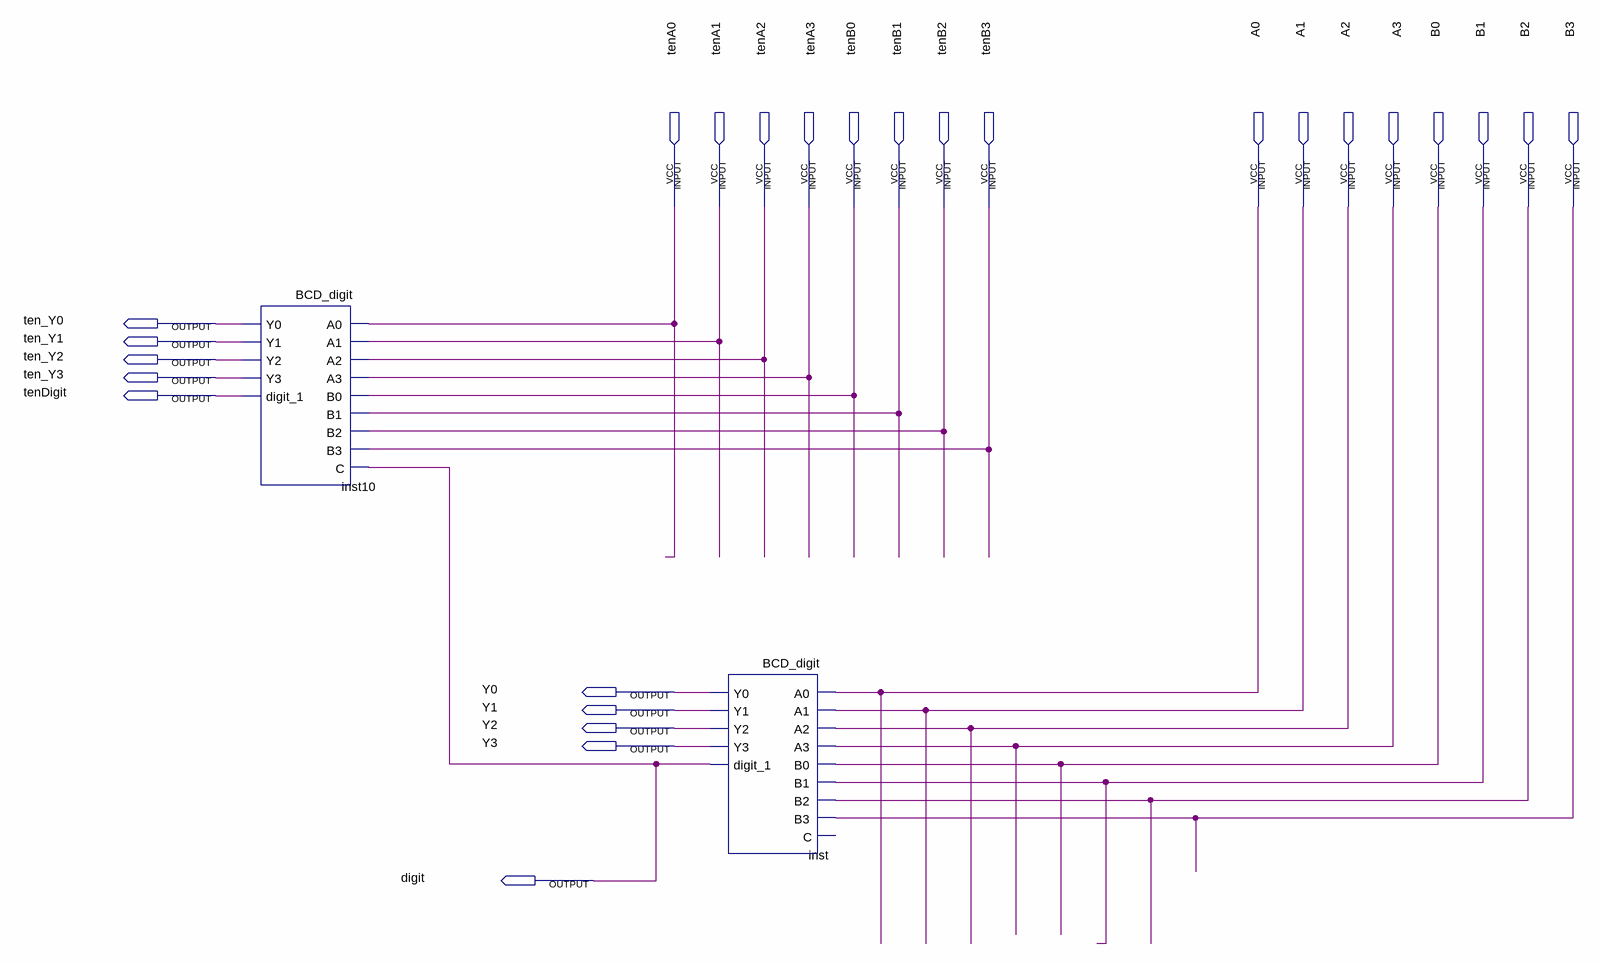
[diagram p0: schematic sheet]
// Quartus schematic BCD_ten_digit.bdf as structural Verilog: 2 symbols, 26 pins
module BCD_ten_digit (
  input  tenA0,
  input  tenA1,
  input  tenA2,
  input  tenA3,
  input  tenB0,
  input  tenB1,
  input  tenB2,
  input  tenB3,
  input  A0,
  input  A1,
  input  A2,
  input  A3,
  input  B0,
  input  B1,
  input  B2,
  input  B3,
  output ten_Y0,
  output ten_Y1,
  output ten_Y2,
  output ten_Y3,
  output tenDigit,
  output Y0,
  output Y1,
  output Y2,
  output Y3,
  output digit
);

  BCD_digit inst10 (
    .A0(tenA0), .A1(tenA1), .A2(tenA2), .A3(tenA3), .B0(tenB0), .B1(tenB1), .B2(tenB2), .B3(tenB3),
    .C(digit), .Y0(ten_Y0), .Y1(ten_Y1), .Y2(ten_Y2), .Y3(ten_Y3), .digit_1(tenDigit));
  BCD_digit inst (
    .A0(A0), .A1(A1), .A2(A2), .A3(A3), .B0(B0), .B1(B1), .B2(B2), .B3(B3), .Y0(Y0), .Y1(Y1), .Y2(Y2),
    .Y3(Y3), .digit_1(digit));  // open: C
endmodule
